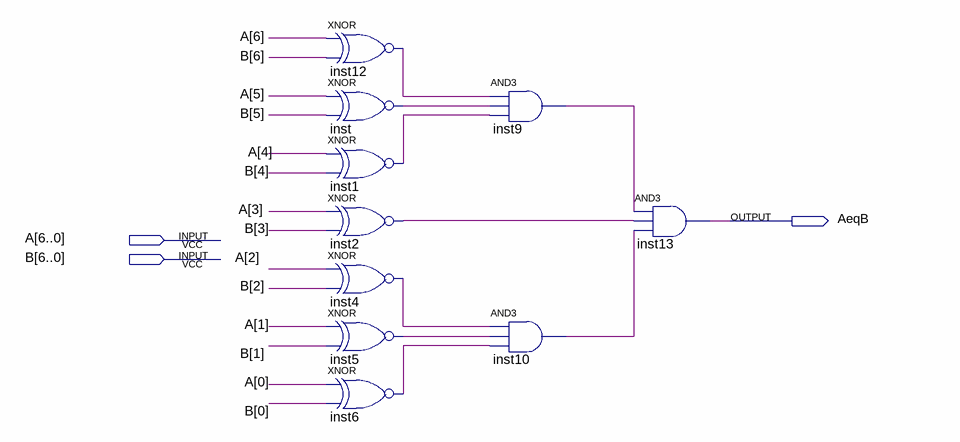
[diagram p0: schematic sheet]
// Quartus schematic g23_comp7.bdf as structural Verilog: 10 symbols, 3 pins
module g23_comp7 (
  input  [6:0] A,
  input  [6:0] B,
  output AeqB
);

  wire inst1_out, inst2_out, inst4_out, inst5_out, inst6_out, inst9_out, inst10_out, inst12_out, inst_out;

  xnor inst12 (inst12_out, A[6], B[6]);
  xnor inst (inst_out, A[5], B[5]);
  xnor inst1 (inst1_out, A[4], B[4]);
  xnor inst2 (inst2_out, A[3], B[3]);
  xnor inst4 (inst4_out, A[2], B[2]);
  xnor inst5 (inst5_out, A[1], B[1]);
  xnor inst6 (inst6_out, A[0], B[0]);
  and inst9 (inst9_out, inst12_out, inst_out, inst1_out);
  and inst10 (inst10_out, inst4_out, inst5_out, inst6_out);
  and inst13 (AeqB, inst9_out, inst2_out, inst10_out);
endmodule
